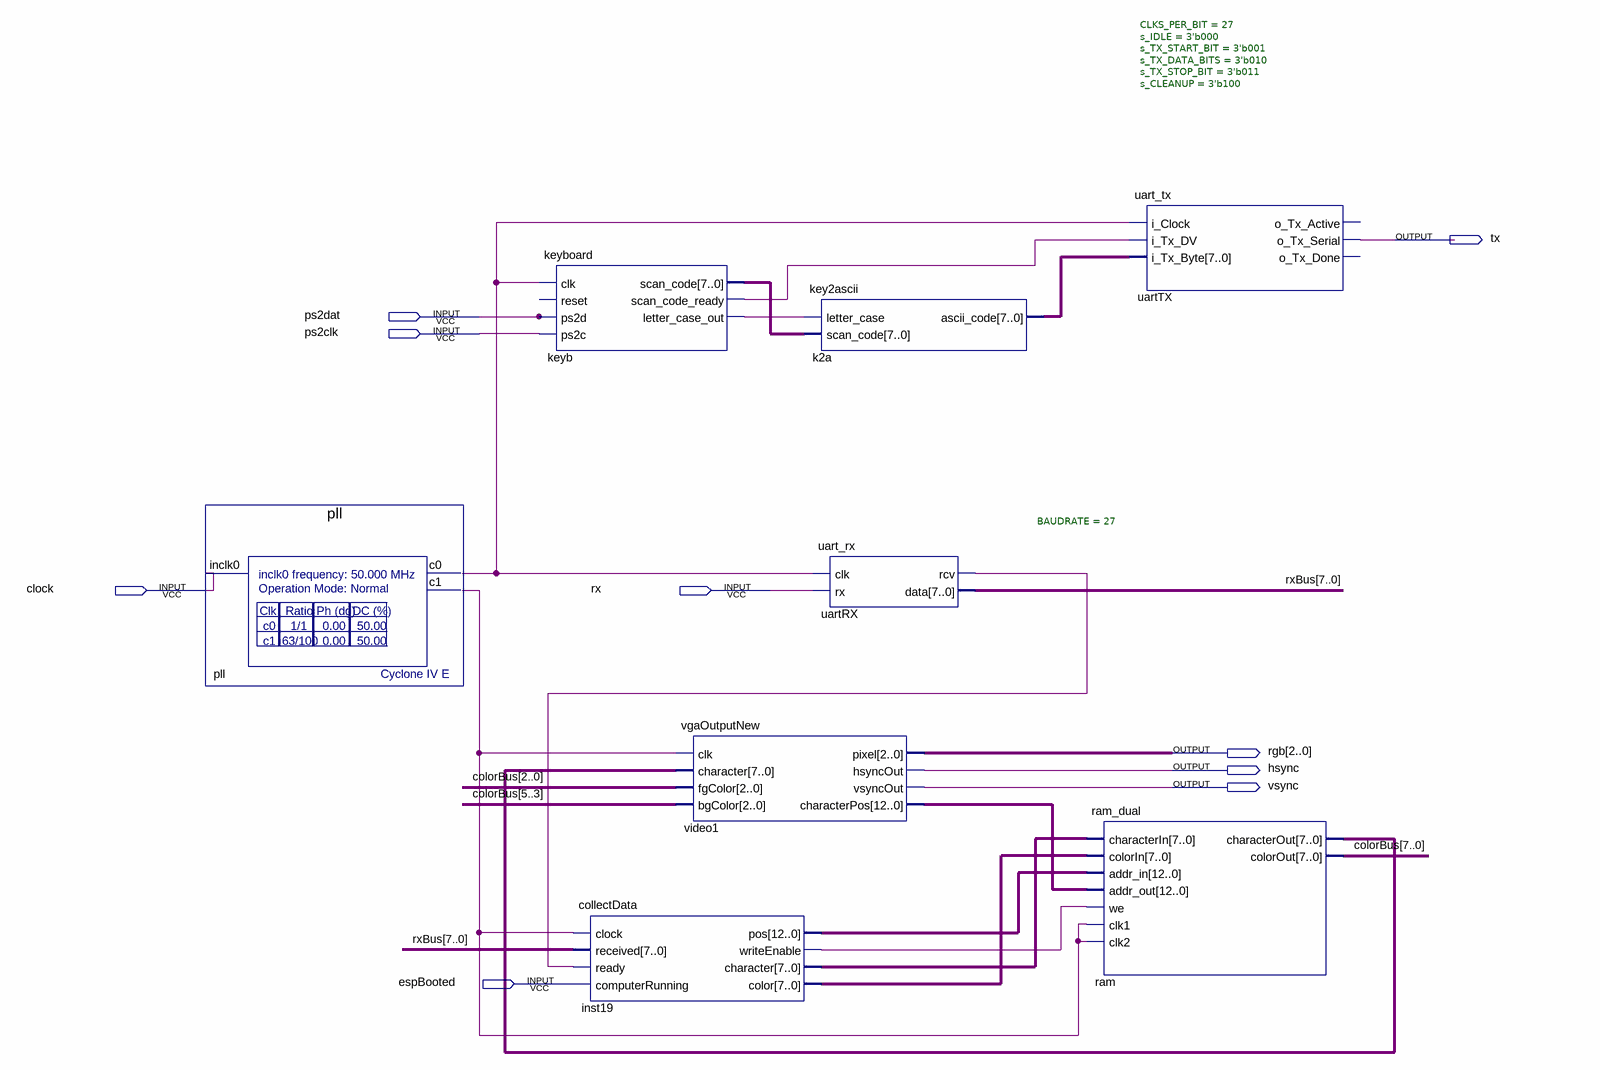
[diagram p0: schematic sheet]
// Quartus schematic asciiVGAVideoCard.bdf as structural Verilog: 8 symbols, 9 pins
module asciiVGAVideoCard (
  input  ps2dat,
  input  ps2clk,
  input  clock,
  input  rx,
  input  espBooted,
  output tx,
  output [2:0] rgb,
  output hsync,
  output vsync
);

  wire inst19_writeenable, keyb_letter_case_out, keyb_scan_code_ready, pll_c0, pll_c1, uartRX_rcv;
  wire [7:0] colorBus, inst19_character, inst19_color, k2a_ascii_code, keyb_scan_code, ram_characterout,
       rxBus;
  wire [12:0] inst19_pos, video1_characterpos;

  pll pll (.inclk0(clock), .c0(pll_c0), .c1(pll_c1));
  keyboard keyb (
    .clk(pll_c0), .ps2d(ps2dat), .ps2c(ps2clk), .scan_code(keyb_scan_code),
    .scan_code_ready(keyb_scan_code_ready), .letter_case_out(keyb_letter_case_out));  // open: reset
  collectData inst19 (
    .clock(pll_c1), .received(rxBus), .ready(uartRX_rcv), .computerRunning(espBooted), .pos(inst19_pos),
    .writeEnable(inst19_writeenable), .character(inst19_character), .color(inst19_color));
  vgaOutputNew video1 (
    .clk(pll_c1), .character(ram_characterout), .fgColor(colorBus[2:0]), .bgColor(colorBus[5:3]),
    .pixel(rgb), .hsyncOut(hsync), .vsyncOut(vsync), .characterPos(video1_characterpos));
  key2ascii k2a (.letter_case(keyb_letter_case_out), .scan_code(keyb_scan_code), .ascii_code(k2a_ascii_code));
  uart_rx #(.BAUDRATE(27)) uartRX (.clk(pll_c0), .rx(rx), .rcv(uartRX_rcv), .data(rxBus));
  uart_tx #(.CLKS_PER_BIT(27), .s_IDLE(3'b000), .s_TX_START_BIT(3'b001), .s_TX_DATA_BITS(3'b010), .s_TX_STOP_BIT(3'b011), .s_CLEANUP(3'b100)) uartTX (
    .i_Clock(pll_c0), .i_Tx_DV(keyb_scan_code_ready), .i_Tx_Byte(k2a_ascii_code), .o_Tx_Serial(tx));  // open: o_Tx_Active, o_Tx_Done
  ram_dual ram (
    .characterIn(inst19_character), .colorIn(inst19_color), .addr_in(inst19_pos),
    .addr_out(video1_characterpos), .we(inst19_writeenable), .clk1(pll_c1), .clk2(pll_c1),
    .characterOut(ram_characterout), .colorOut(colorBus));
endmodule
